# Altium project SAC_Dekoder.PrjPcb
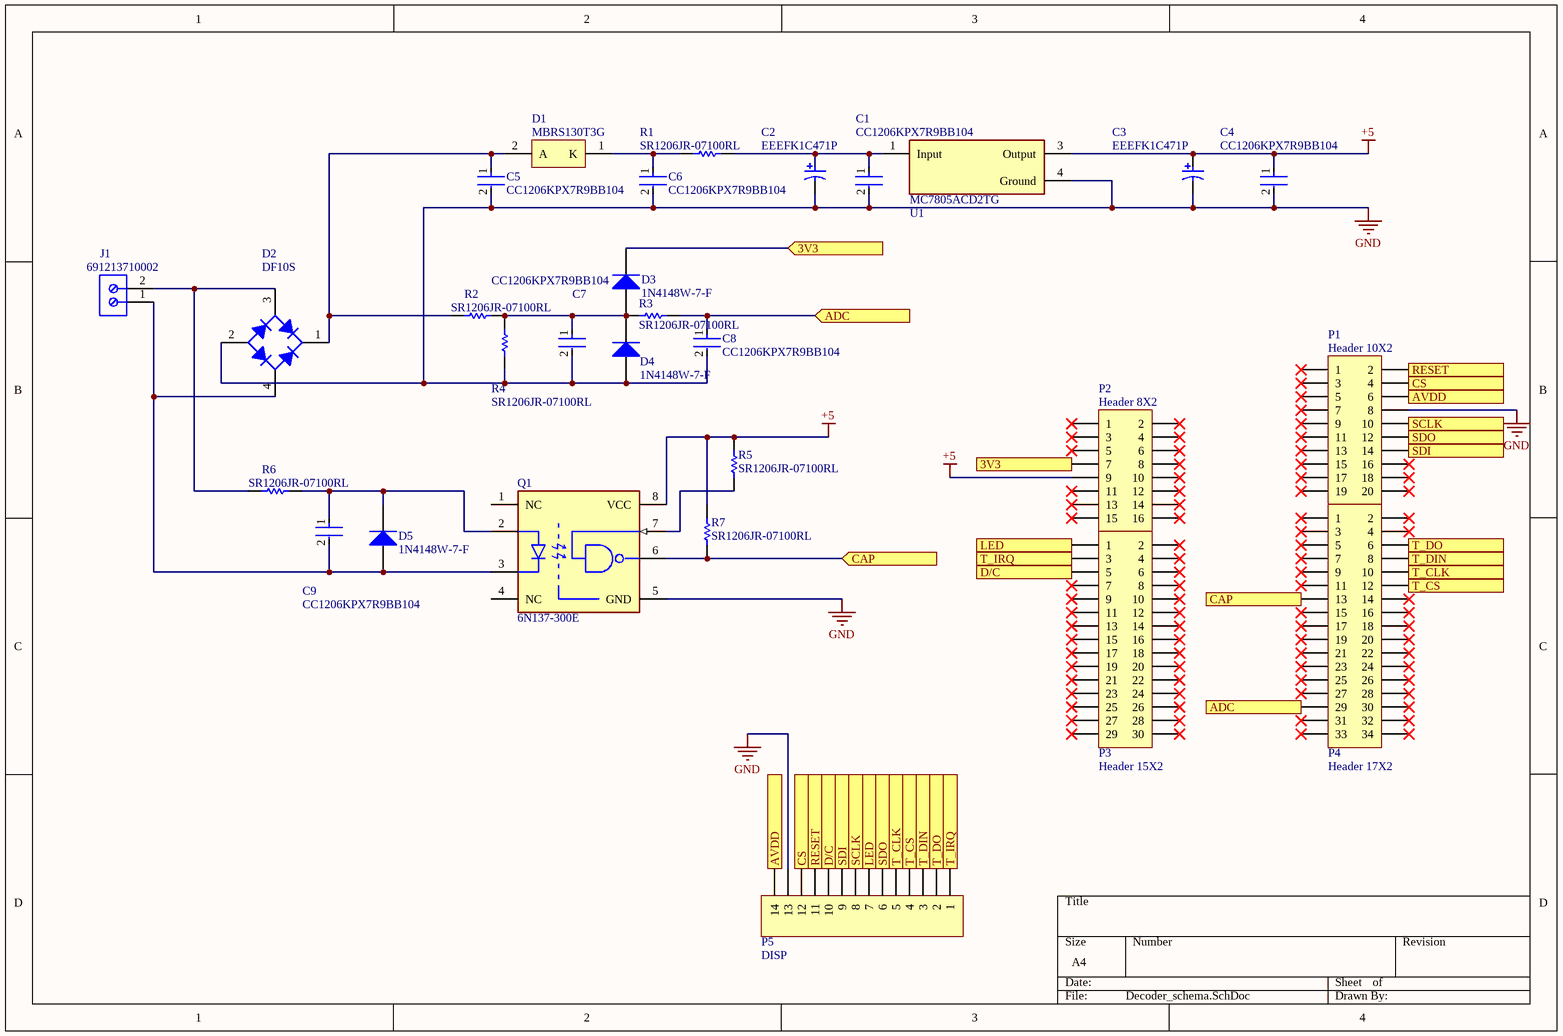
[diagram p0: Decoder_schema.SchDoc]
1 sheet, 29 parts. Net scope: flat (ports and power ports of the same name join across sheets).
Board file: SAC_Dekoder.PcbDoc

## Sheet Decoder_schema.SchDoc
size A4

### Parts
C1  CC1206KPX7R9BB104  [FP-CC1206-1_25-MFG]
C2  EEEFK1C471P  [PNSC-FK-V-F_V]
C3  EEEFK1C471P  [PNSC-FK-V-F_V]
C4  CC1206KPX7R9BB104  [FP-CC1206-1_25-MFG]
C5  CC1206KPX7R9BB104  [FP-CC1206-1_25-MFG]
C6  CC1206KPX7R9BB104  [FP-CC1206-1_25-MFG]
C7  CC1206KPX7R9BB104  [FP-CC1206-1_25-MFG]
C8  CC1206KPX7R9BB104  [FP-CC1206-1_25-MFG]
C9  CC1206KPX7R9BB104  [FP-CC1206-1_25-MFG]
D1  MBRS130T3G  [ONSC-SMB-2-403A-03_V]
D2  DF10S  [FAIR-SDIP-4_V]
D3  1N4148W-7-F  [DIOD-SOD123-2_V]
D4  1N4148W-7-F  [DIOD-SOD123-2_V]
D5  1N4148W-7-F  [DIOD-SOD123-2_V]
J1  691213710002  [691213710002]
P1  Header 10X2  [HDR2X10]
P2  Header 8X2  [HDR2X8]
P3  Header 15X2  [HDR2X15]
P4  Header 17X2  [HDR2X17]
P5  DISP  [HDR1X14]
Q1  6N137-300E  [FP-6N137-300E-MFG]
R1  SR1206JR-07100RL  [RESC3216X65X40LL10T20]
R2  SR1206JR-07100RL  [RESC3216X65X40LL10T20]
R3  SR1206JR-07100RL  [RESC3216X65X40LL10T20]
R4  SR1206JR-07100RL  [RESC3216X65X40LL10T20]
R5  SR1206JR-07100RL  [RESC3216X65X40LL10T20]
R6  SR1206JR-07100RL  [RESC3216X65X40LL10T20]
R7  SR1206JR-07100RL  [RESC3216X65X40LL10T20]
U1  MC7805ACD2TG  [ONSC-D2PAK-3-936-03_V]

### Ports
3V3 (in), ADC (in), AVDD (in), CAP (in), CS (in), D/C (in), LED (in), RESET (in), SCLK (in), SDI (in), SDO (in), T_CLK (in), T_CS (in), T_DIN (in), T_DO (in), T_IRQ (in)

### Nets
+5: C3.1 C4.1 P2.9 Q1.8(VCC) R5.2 R7.2 U1.3(Output)
GND: C1.2 C2.2 C3.2 C4.2 C5.2 C6.2 C7.2 C8.2 D2.2(A) D4.1(A) P1.8 P5.13 Q1.5(GND) R4.1 U1.4(Ground)
NetC1_1: C1.1 C2.1 R1.2 U1.1(Input)
NetC5_1: C5.1 D1.2(A) D2.1(K) R2.1
NetC6_1: C6.1 D1.1(K) R1.1
NetC7_1: C7.1 D3.1(A) D4.2(K) R2.2 R3.2 R4.2
NetC8_1: C8.1 P4.29 R3.1 ; port ADC
NetC9_1: C9.1 D5.2(K) Q1.2(A) R6.2
NetC9_2: C9.2 D2.4(C) D5.1(A) J1.1 Q1.3(C)
NetD2_3: D2.3(C) J1.2 R6.1
NetD3_2: D3.2(K) P2.7 ; port 3V3
NetP1_2: P1.2 P5.11 ; port RESET
NetP1_4: P1.4 P5.12 ; port CS
NetP1_6: P1.6 P5.14 ; port AVDD
NetP1_10: P1.10 P5.8 ; port SCLK
NetP1_12: P1.12 P5.6 ; port SDO
NetP1_14: P1.14 P5.9 ; port SDI
NetP3_1: P3.1 P5.7 ; port LED
NetP3_3: P3.3 P5.1 ; port T_IRQ
NetP3_5: P3.5 P5.10 ; port D/C
NetP4_6: P4.6 P5.2 ; port T_DO
NetP4_8: P4.8 P5.3 ; port T_DIN
NetP4_10: P4.10 P5.5 ; port T_CLK
NetP4_12: P4.12 P5.4 ; port T_CS
NetP4_13: P4.13 Q1.6(VO) R7.1 ; port CAP
NetQ1_7: Q1.7(VE) R5.1

Not connected (* = marked no-connect by the designer): P1 1* 3* 5* 7* 9* 11* 13* 15* 16* 17* 18* 19* 20*; P2 1* 2* 3* 4* 5* 6* 8* 10* 11* 12* 13* 14* 15* 16*; P3 2* 4* 6* 7* 8* 9* 10* 11* 12* 13* 14* 15* 16* 17* 18* 19* 20* 21* 22* 23* 24* 25* 26* 27* 28* 29* 30*; P4 1* 2* 3* 4* 5* 7* 9* 11* 14* 15* 16* 17* 18* 19* 20* 21* 22* 23* 24* 25* 26* 27* 28* 30* 31* 32* 33* 34*; Q1 1(NC) 4(NC)

### Library data of the parts
C1 C4-C9 = CMP-03422-000130-1: CC1206 100 nF X7R 10.00%50 V; Manufacturer: Yageo; Capacitance: 100 nF; Tolerance: 0.1; Value: 100 nF; Temperature Coefficient: 15%; Material: Ceramic; Voltage Rating: 50 V; Automotive Grade: NA; Octopart: https://octopart.com/cc1206kpx7r9bb104-yageo-16251820; Footprint Url: http://www.yageo.com/exep/pages/download/literatures/UPY-C_GEN_24.pdf; ComponentLink2Description: Datasheet; Temperature Range Low: -55°C; Temperature: -55°C to +125°C; RoHS: TRUE; Mouser Description: Surface Mount Ceramic Multilayer Capacitor 0.1uF 10% X7R 50V 1206 Paper T/R; Device Class L1: Passive Components; Height: 1.45mm; Device Class L3: Ceramic Capacitors; Manufacturer Part Number: CC1206KPX7R9BB104; Temperature Characteristic: X7R; Device Class L2: Capacitors; Package: CC1206-1.25; Category: Cap; Lead Free: Yes; Automotive: No; ComponentLink2URL: http://www.yageo.com/documents/recent/UPY-NP0X7R_HV_1KV-to-3KV_11.pdf; Temperature Range High: +125°C
C2 C3 = CMP-2000-06204-1: Aluminum Electrolytic Capacitor, 470 uF, +/- 20%, 16 V, 2-Pin SMD (Size Code F), -55 to 105 degC, RoHS, Tape and Reel; Manufacturer: Panasonic; Capacitance: 470µF; Type: Can; Ripple Current: 600mA; Lifetime@Temperature: 2000Hrs@105°C; Impedance: 0.16O; Rated Voltage: 16V; Manufacturer URL: http://www.panasonic.com/; Package Description: 2-Pin Electrolytic Aluminum Capacitor, Body 8.3 x 8.3 mm; Operating Temp-Max: 105°C; Mounting Technology: SurfaceMount; Operating Temp Range: -55to+105°C; Datasheet Version: 03/2016; Series: FK; Package Reference: FK-V-F; Case Size/Dimension: Ø8x10.2mm; Package URL: http://industrial.panasonic.com/cdbs/www-data/pdf/RDE0000/DME0000COL48.pdf; Datasheet URL: http://industrial.panasonic.com/cdbs/www-data/pdf/RDE0000/ABA0000C1181.pdf
D1 = CMP-1055-00363-1: Schottky Power Rectifier, 2-Pin SMB, Pb-Free, Tape and Reel; Manufacturer: On Semiconductor; Configuration: Single; IFSM Max (A): 40; DatasheetVersion: Rev. 7; ComponentLink1Description: Manufacturer URL; Mounting Technology: Surface Mount; ComponentLink3Description: Package Specification; ComponentLink2URL: http://www.onsemi.cn/pub_link/Collateral/MBRS130T3-D.PDF; Packing: Tape and Reel; ComponentLink2Description: Datasheet; PartNumber: MBRS130T3G; PackageVersion: Rev. J, 07/2012; PackageReference: SMB-2-403A-03; PackageDescription: 2-Pin Small Molded Package, J-Bend Lead, Body 4.33 x 3.625 mm; ComponentLink1URL: http://www.onsemi.com/; ComponentLink3URL: http://www.onsemi.com/pub_link/Collateral/403A-03.PDF; RoHS: TRUE
D2 = CMP-2000-06153-1: Bridge Rectifier, 1.5 A, 1000 V, 4-Pin SDIP, RoHS, Tape and Reel; Manufacturer: FairchildSemiconductor; Configuration: Single; Peak Average Forward Current: 1.5@Ta=40CA; Peak Reverse Repetitive Voltage: 1000V; Peak Reverse Current: 5uA; Bridge Type: SinglePhase; Peak Forward Voltage: 1.1@1AV; Datasheet Version: Rev. 1.5, 05/2015; Package: 4SDIPSMD; Operating Temperature: -55to150°C; Package Reference: SDIP 4L; Datasheet URL: http://www.farnell.com/datasheets/1941063.pdf; Packaging: Tape&Reel; Manufacturer URL: https://www.fairchildsemi.com/; Mounting Technology: SurfaceMount; Category: BridgeRectifier; Package Description: 4-Pin Surface Mount Device, Body 8.28 x 6.35 mm, Pitch 5.1 mm; Mounting: SurfaceMount
D3-D5 = CMP-2000-04932-2: Fast Switching Diode, 100 V, 0.15 A, -65 to 150 degC, 2-Pin?SOD123, RoHS, Tape and Reel; Recovery Time: 4ns; Brand: DiodesIncorporated; Unit Weight: 0.000353oz; Max Surge Current: 2A; Peak Reverse Voltage: 100V; Ir - Reverse Current: 1uA; Vf - Forward Voltage: 1.25V; Configuration: Single; If - Forward Current: 0.15A; Product Category: Diodes-GeneralPurpose,Power,Switching; Operating Temperature Range: -65Cto+150C; Packaging: Reel; Manufacturer URL: http://www.diodes.com/; Maximum Operating Temperature: +150C; Height: 1.25mm; Minimum Operating Temperature: -65C; Product: SwitchingDiodes; Package URL: http://www.diodes.com/datasheets/ds18004.pdf; Type: SwitchingDiode; Package Reference: SOD123-2; Width: 1.7mm; Datasheet URL: http://www.farnell.com/datasheets/1915529.pdf; Datasheet Version: Rev. 24-2, 10/2013; Series: 1N4148; Factory Pack Quantity: 3000; Length: 2.85mm; RoHS: True; Manufacturer: DiodesIncorporated; Mounting Style: SMD/SMT; Package / Case: SOD-123
J1 = CMP-1502-02526-1: Serie 213 - 5.00 mm Horizontal Entry Modular with RisingCage Clamp WR-TBL, 2 pin; Manufacturer: Wurth Elektronik; Pin Number: 2; Pitch: 5.00mm; Packaging: Box; Datasheet URL: http://katalog.we-online.de/em/datasheet/6912137100xx.pdf; Mounting Technology: THT; Part Number: 691213710002; Operating Temperature: -40to105degC; Publisher: WurthElektronik; Manufacturer URL: http://www.we-online.de; Package Reference: 691213710002
P1 = Header 10X2: Header, 10-Pin, Dual row; LatestRevisionDate: 17-Jul-2002; LatestRevisionNote: Re-released for DXP Platform.; Publisher: Altium Limited
P2 = Header 8X2: Header, 8-Pin, Dual row; LatestRevisionDate: 17-Jul-2002; LatestRevisionNote: Re-released for DXP Platform.; Publisher: Altium Limited
P3 = Header 15X2: Header, 15-Pin, Dual row; LatestRevisionDate: 17-Jul-2002; LatestRevisionNote: Re-released for DXP Platform.; Publisher: Altium Limited
P4 = Header 17X2: Header, 17-Pin, Dual row; LatestRevisionDate: 17-Jul-2002; LatestRevisionNote: Re-released for DXP Platform.; Publisher: Altium Limited
P5 = Header 14: Header, 14-Pin; LatestRevisionDate: 17-Jul-2002; LatestRevisionNote: Re-released for DXP Platform.; Publisher: Altium Limited
Q1 = CMP-18400-000015-1: OPTOISO 3.75KV OPN COLL 8DIP GW; Manufacturer: Broadcom; Min Supply Voltage: 4.5V; Forward Voltage: 1.5V; Turn Off Delay Time: 50ns; Standoff Height: 0.505mm; Reverse Voltage: 5V; Isolation Voltage: 3750Vrms; Forward Current: 10mA; Turn On Delay Time: 48ns; Max Supply Voltage: 5.5V; Package: 0; Automotive: No; Lead Free: Yes; ComponentLink2Description: Datasheet; Temperature: -40°C to +85°C; Device Class L3: unset; Height: 4.455mm; Ambient Temperature Range Low: -40°C; Digikey Description: OPTOISO 3.75KV OPN COLL 8DIP GW; Temperature Range Low: -40°C; ComponentLink2URL: https://docs.broadcom.com/docs/AV02-0940EN; Mouser Description: High Speed Optocouplers 10 Mb/s 3750Vrms; Category: Trans; Ambient Temperature Range High: +85°C; RoHS: TRUE; Octopart: https://octopart.com/6n137-300e-broadcom-71125550; Manufacturer Part Number: 6N137-300E; Device Class L1: Optoelectronics; Device Class L2: Optocouplers; Temperature Range High: +85°C
R1-R7 = CMP-2003-04696-1: Manufacturer: Yageo; Part Number: SR1206JR-07100RL
U1 = CMP-07128-000005-1: IC REG LINEAR 5V 1A DPAK; Manufacturer: ON Semiconductor; Manufacturer Part Number: MC7805CDTG; Number Of Outputs: 1; Standoff Height: 0mm; Description: Linear Voltage Regulator IC  1 Output  1A DPAK; Output Type: Fixed; Nominal Supply Current: 3.2mA; Dropout Voltage: 2V; Max Supply Voltage: 35V; Max Junction Temp: +125°C; Min Supply Voltage: 7V; Mouser Description: Linear Voltage Regulator, Positive, 5.0 V, 1.0 A, V out : 5.0 V; T J = 0Â°C to +125Â°C; Package: 369C; Output Voltage: 5V; Octopart: https://octopart.com/mc7805cdtg-on+semiconductor-1266408; Lead Free: Yes; Temperature Range Low: 0°C; Automotive: No; Temperature Range High: +125°C; Temperature: 0°C to +125°C; RoHS: TRUE; ComponentLink2Description: Datasheet; ComponentLink2URL: https://www.onsemi.cn/PowerSolutions/document/MC7800-D.PDF; Device Class L3: Voltage Regulators - Linear; Footprint Url: https://www.onsemi.com/pub/Collateral/369C.PDF; Device Class L1: Integrated Circuits (ICs); Digikey Description: IC REG LINEAR 5V 1A DPAK; Output Current: 1A; Device Class L2: Power Management ICs; Height: 2.51mm; Category: IC